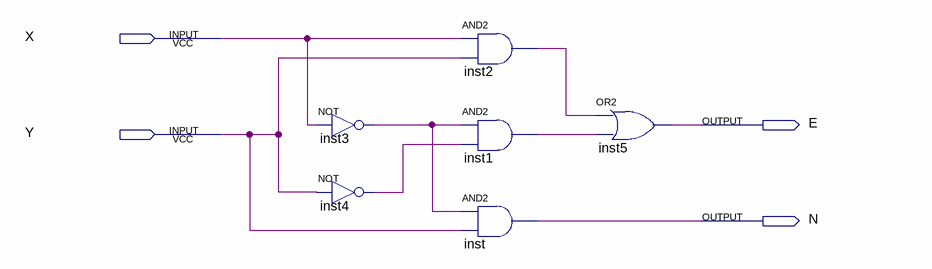
[diagram p0: schematic sheet]
// Quartus schematic 1_bit-comparator.bdf as structural Verilog: 6 symbols, 4 pins
module \1_bit-comparator  (
  input  X,
  input  Y,
  output E,
  output N
);

  wire inst1_out, inst2_out, inst3_out, inst4_out;

  not inst3 (inst3_out, X);
  not inst4 (inst4_out, Y);
  and inst2 (inst2_out, X, Y);
  and inst1 (inst1_out, inst3_out, inst4_out);
  and inst (N, inst3_out, Y);
  or inst5 (E, inst2_out, inst1_out);
endmodule
